# Altium schematic sheet CAN.SchDoc: CAN
size 420 x 297 mm; Date: March 14; CheckedBy: ThS. Bùi Quốc Bảo; DrawnBy: Nguyễn Gia Huy; Revision: V1.0; SheetNumber: 8; SheetTotal: 11; MasterProject: STM32-PLC; Sub-system: DA1_prj.PrjPcb
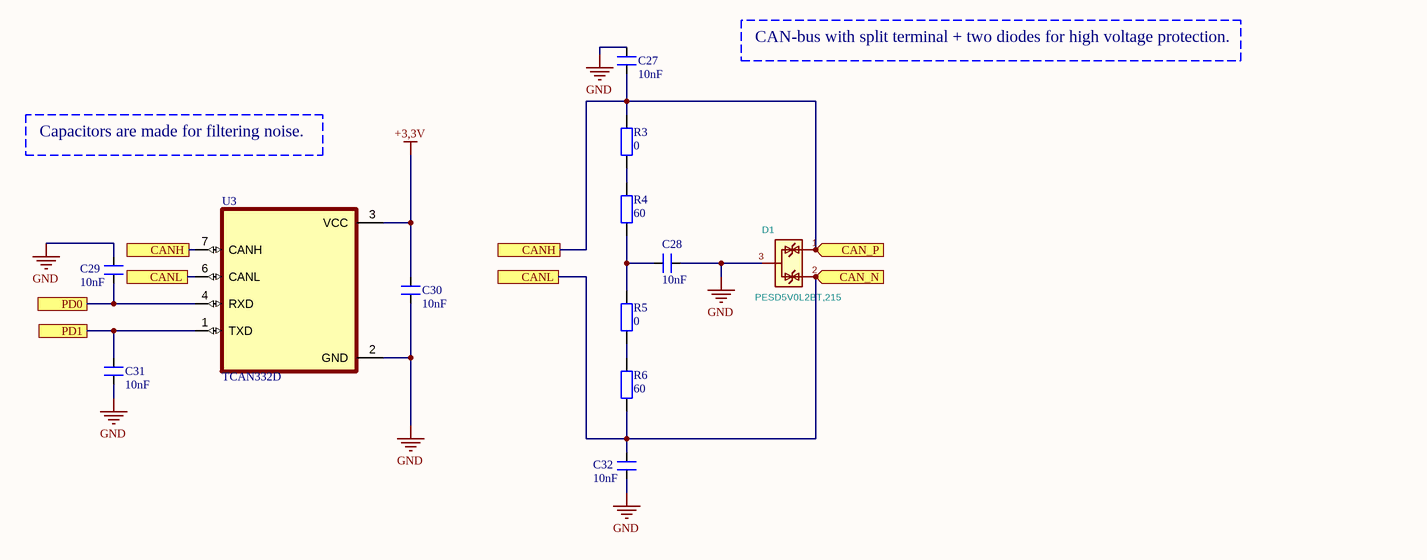
[diagram p0: CAN.SchDoc]

## Parts
C27  10nF  [FP-C0603C-CF-IPC_A]
C28  10nF  [FP-C0603C-CF-IPC_A]
C29  10nF  [FP-C0603C-CF-IPC_A]
C30  10nF  [FP-C0603C-CF-IPC_A]
C31  10nF  [FP-C0603C-CF-IPC_A]
C32  10nF  [FP-C0603C-CF-IPC_A]
D1  PESD5V0L2BT,215  [SOT95P230X110-3N]
R3  0  [tro smd 0603]
R4  60  [tro smd 0603]
R5  0  [tro smd 0603]
R6  60  [tro smd 0603]
U3  TCAN332D  [SOIC127P599X175-8N]

## Ports
CAN_N (in, see STM32_PLC[6B]), CAN_P (in, see STM32_PLC[6B]), CANH (see CAN[2B]), CANH (see CAN[3B]), CANL (see CAN[2B]), CANL (see CAN[3B]), PD0 (see STM32_PLC[2C], STM32_PLC[6B]), PD1 (see STM32_PLC[2C], STM32_PLC[6B])

## Nets
+3,3V: C30.2 U3.3(VCC)
GND: C27.1 C28.1 C29.2 C30.1 C31.1 C32.1 D1.3(A) U3.2(GND)
CAN_N: C32.2 D1.2(K) R6.1 U3.6(CANL) ; port CANL, port CAN_N
CAN_P: C27.2 D1.1(K) R3.2 U3.7(CANH) ; port CANH, port CAN_P
PD0: C29.1 U3.4(RXD) ; port PD0
PD1: C31.2 U3.1(TXD) ; port PD1
NetC28_2: C28.2 R4.1 R5.2
NetR3_1: R3.1 R4.2
NetR5_1: R5.1 R6.2

## Notes on the sheet
- CAN-bus with split terminal + two diodes for high voltage protection.
- Capacitors are made for filtering noise.
- Sub-system:
- Project:
- Design by:
- Sheet title:
- Sheet
- of
- Checked by:
- Approved by:
- Doc No:
- Revision:
- Size:
- Dates:
- A3

## Library data of the parts
C27-C32 = CN-SEMI-DIP: Capacitor (Semiconductor SIM Model); Value: 104; LatestRevisionDate: 17-Jul-2002; LatestRevisionNote: Re-released for DXP Platform.; PackageReference: C1206; Publisher: Altium Limited
D1 = NUP2105L: Mouser Eletronics: 755-MMBZ6V8ALFHT116; Value: PESD5V0L2BT,215; Footprint: Package_TO_SOT_SMD:SOT-23
R3-R6 = Tro 0603 1% 10k: RES; Chung_Loai: Dán; Don_Vi: Con; So_Chan: 2; Ten_Linh_Kien: Trở 0603 1% 10k; Ma_Hang: MH006333; Kieu_Chan: *
U3 = TCAN332D: 3.3-V CAN Transceivers; MF: Texas Instruments; SnapEDA_Link: https://www.snapeda.com/parts/TCAN332D/Texas+Instruments/view-part/?ref=snap; Package: SOIC-8 Texas Instruments; Value: *; MP: TCAN332D; Check_prices: https://www.snapeda.com/parts/TCAN332D/Texas+Instruments/view-part/?ref=eda